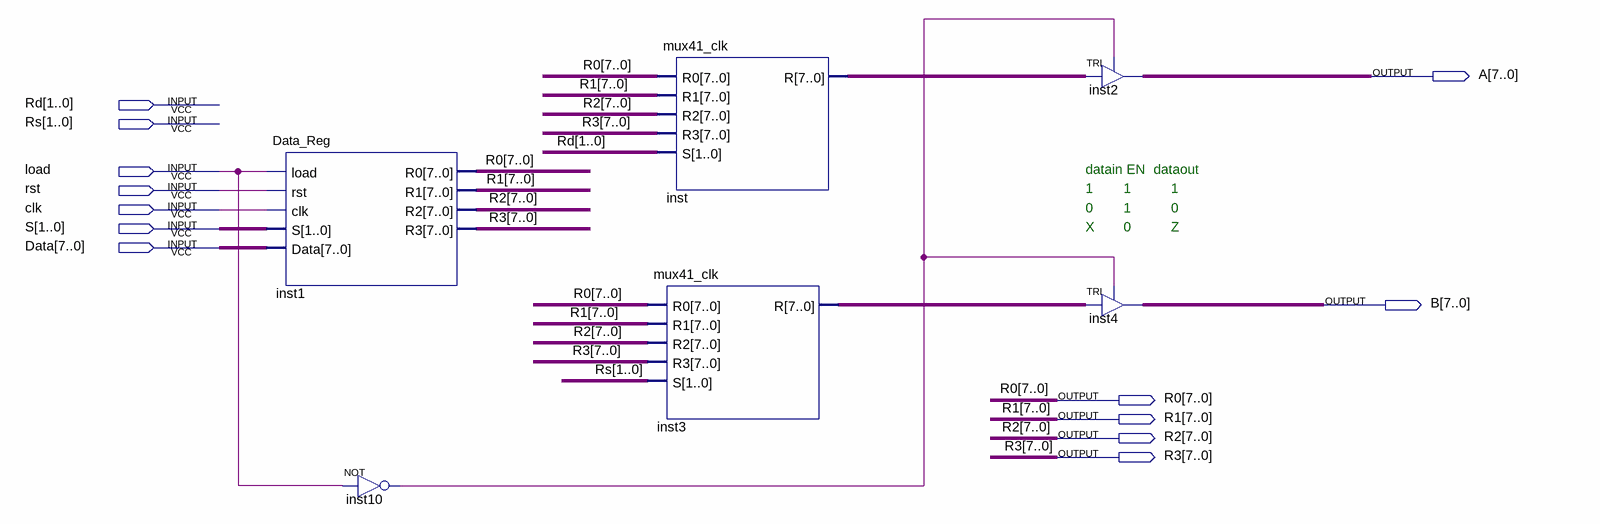
[diagram p0: schematic sheet]
// Quartus schematic DR_R.bdf as structural Verilog: 6 symbols, 13 pins
module DR_R (
  input  [1:0] Rd,
  input  [1:0] Rs,
  input  load,
  input  rst,
  input  clk,
  input  [1:0] S,
  input  [7:0] Data,
  output [7:0] A,
  output [7:0] B,
  output [7:0] R0,
  output [7:0] R1,
  output [7:0] R2,
  output [7:0] R3
);

  wire inst10_out;
  wire [7:0] inst3_r, inst_r;

  Data_Reg inst1 (.load(load), .rst(rst), .clk(clk), .S(S), .Data(Data), .R0(R0), .R1(R1), .R2(R2), .R3(R3));
  not inst10 (inst10_out, load);
  mux41_clk inst (.R0(R0), .R1(R1), .R2(R2), .R3(R3), .S(Rd), .R(inst_r));
  mux41_clk inst3 (.R0(R0), .R1(R1), .R2(R2), .R3(R3), .S(Rs), .R(inst3_r));
  TRI inst2[7:0] (.IN(inst_r), .OE(inst10_out), .OUT(A));
  TRI inst4[7:0] (.IN(inst3_r), .OE(inst10_out), .OUT(B));

  // Notes on the sheet:
  //   datain EN  dataout
  //   1
  //   1
  //   1
  //   0
  //   1
  //   0
  //   X
  //   0
  //   Z
endmodule
